# EasyEDA Pro project ProPrj_氢气传感器（已标定模块）_2025-02-25.epro

# Schematic Schematic1

## Sheets
1 P1: Board Name: Board1; Create Date: 2025-02-25; Page Name: P1; Project Name: 氢气传感器（已标定模块）; Schematic Name: Schematic1; Update Date: 2025-02-25; Company: 嘉立创EDA; Page Size: A4; Version: V1.0
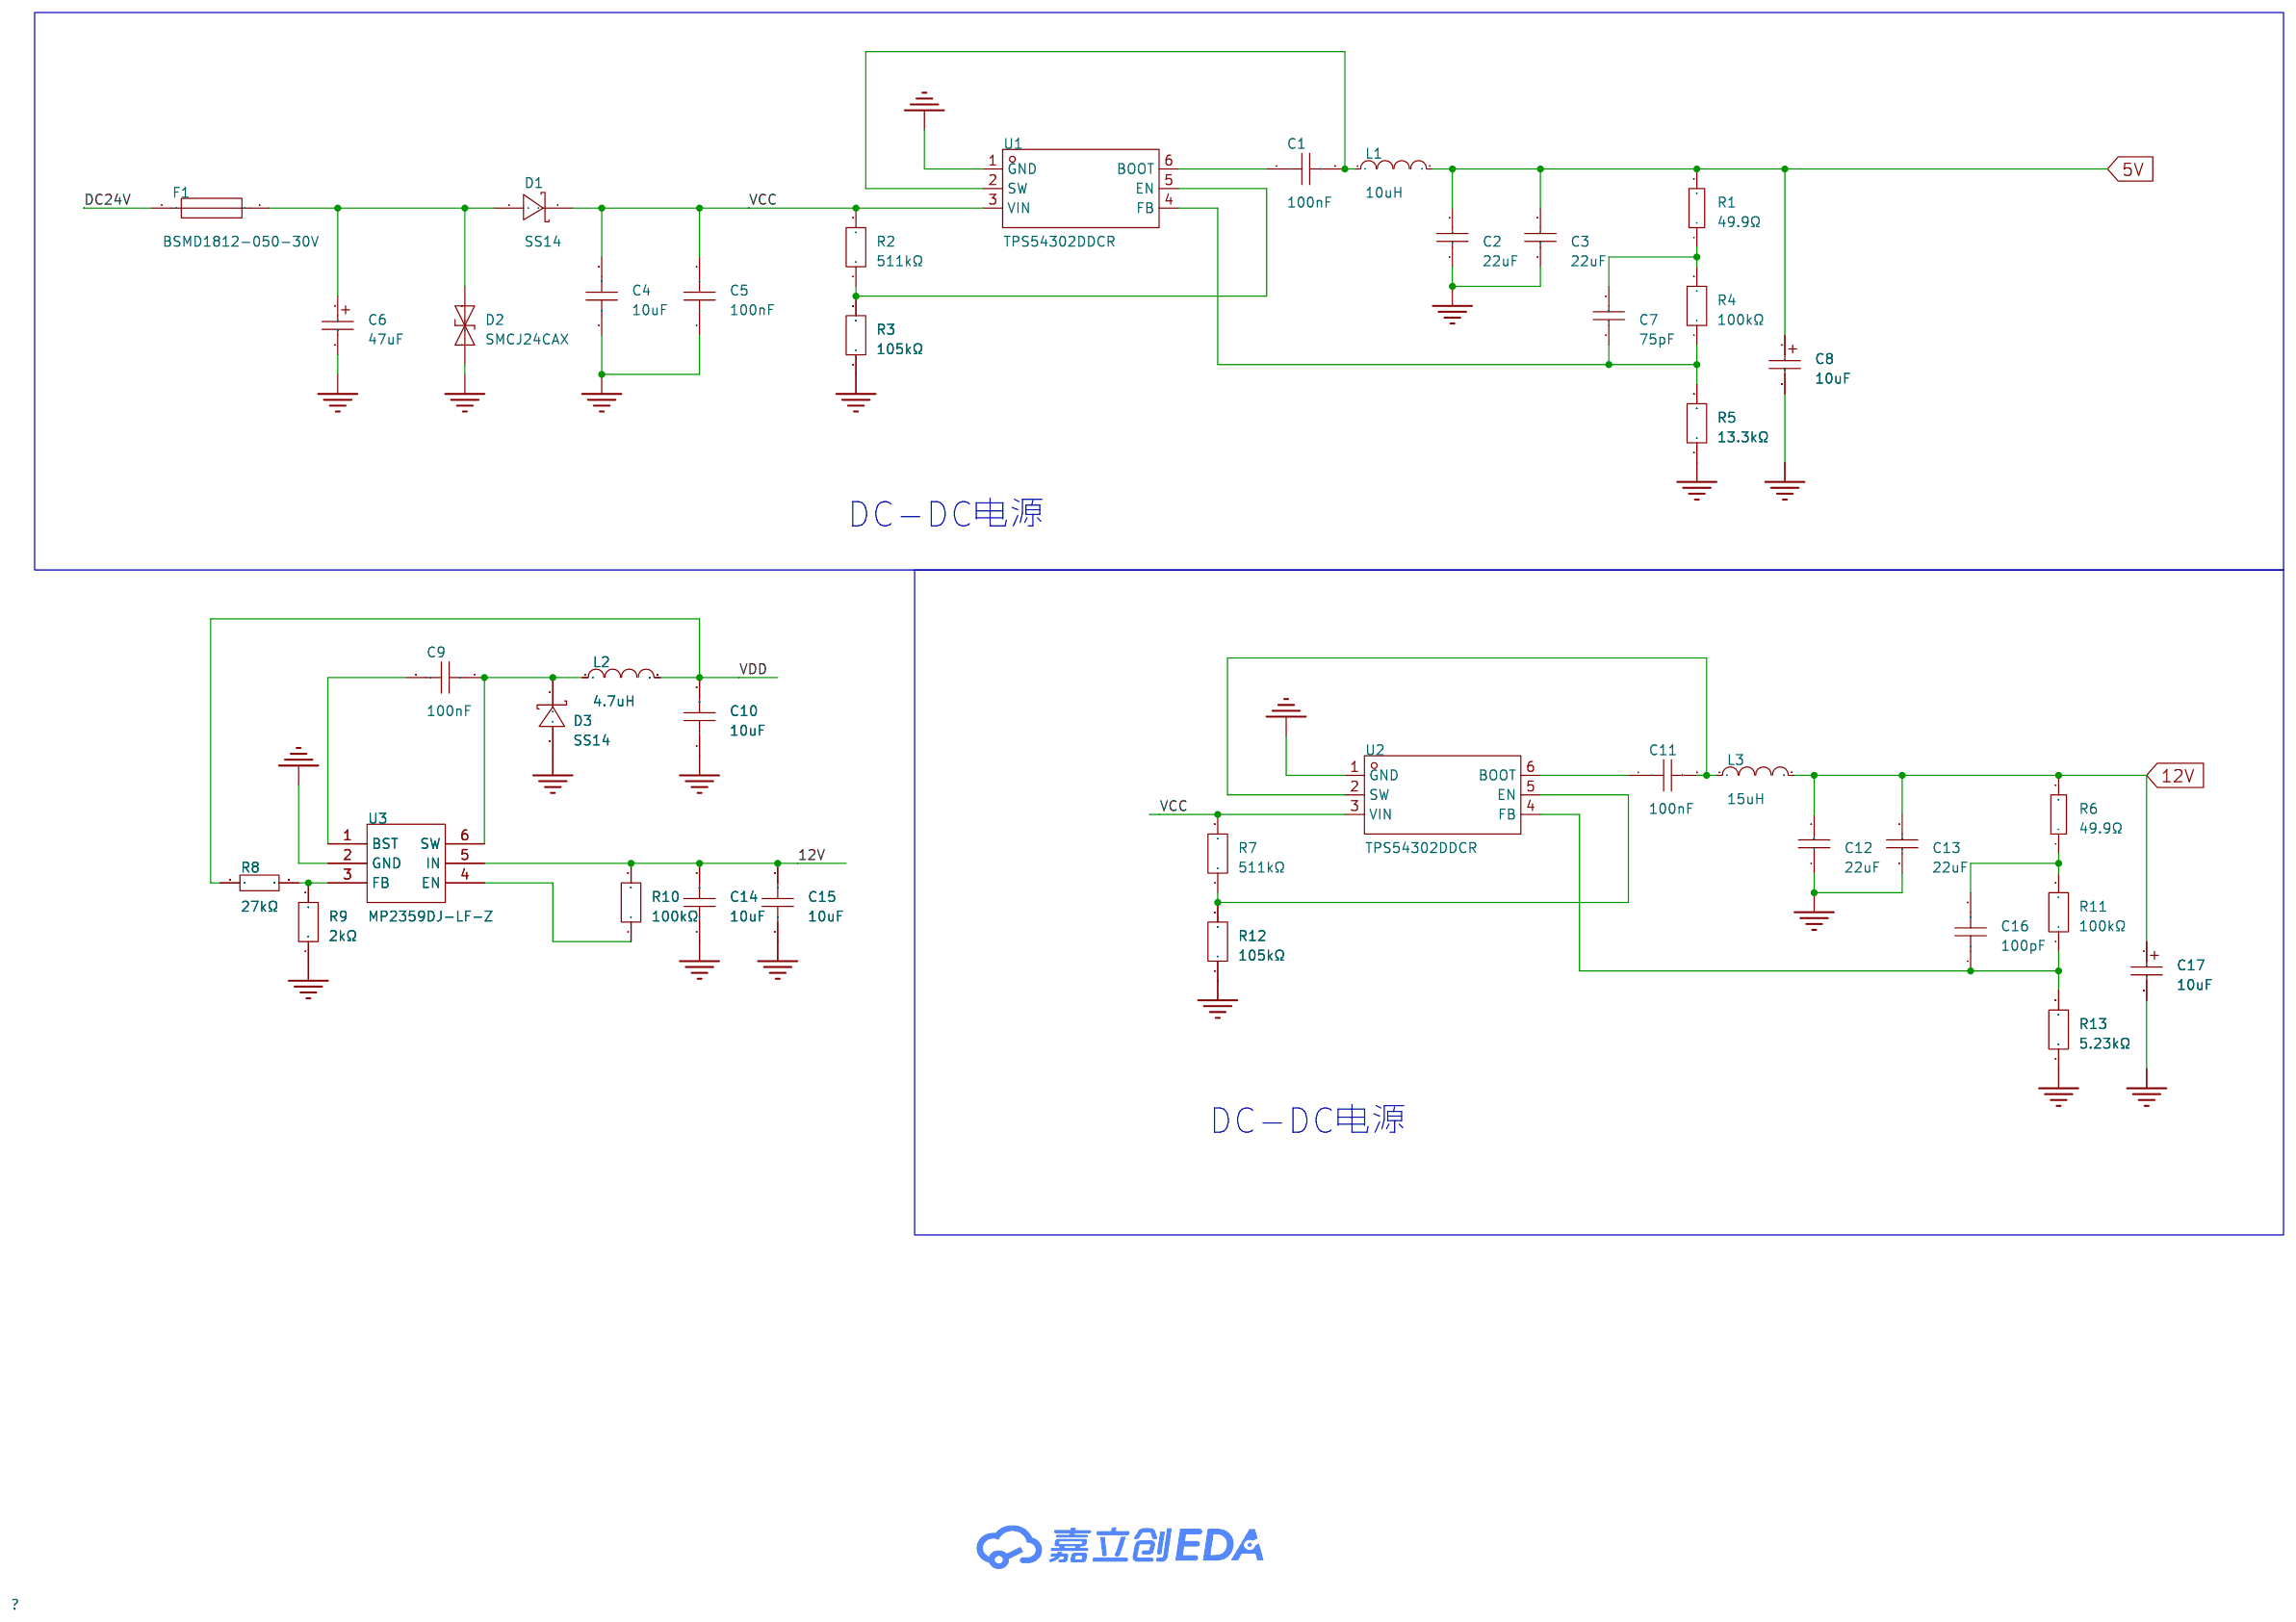
[diagram p0: P1]
2 P2: Page Name: P2
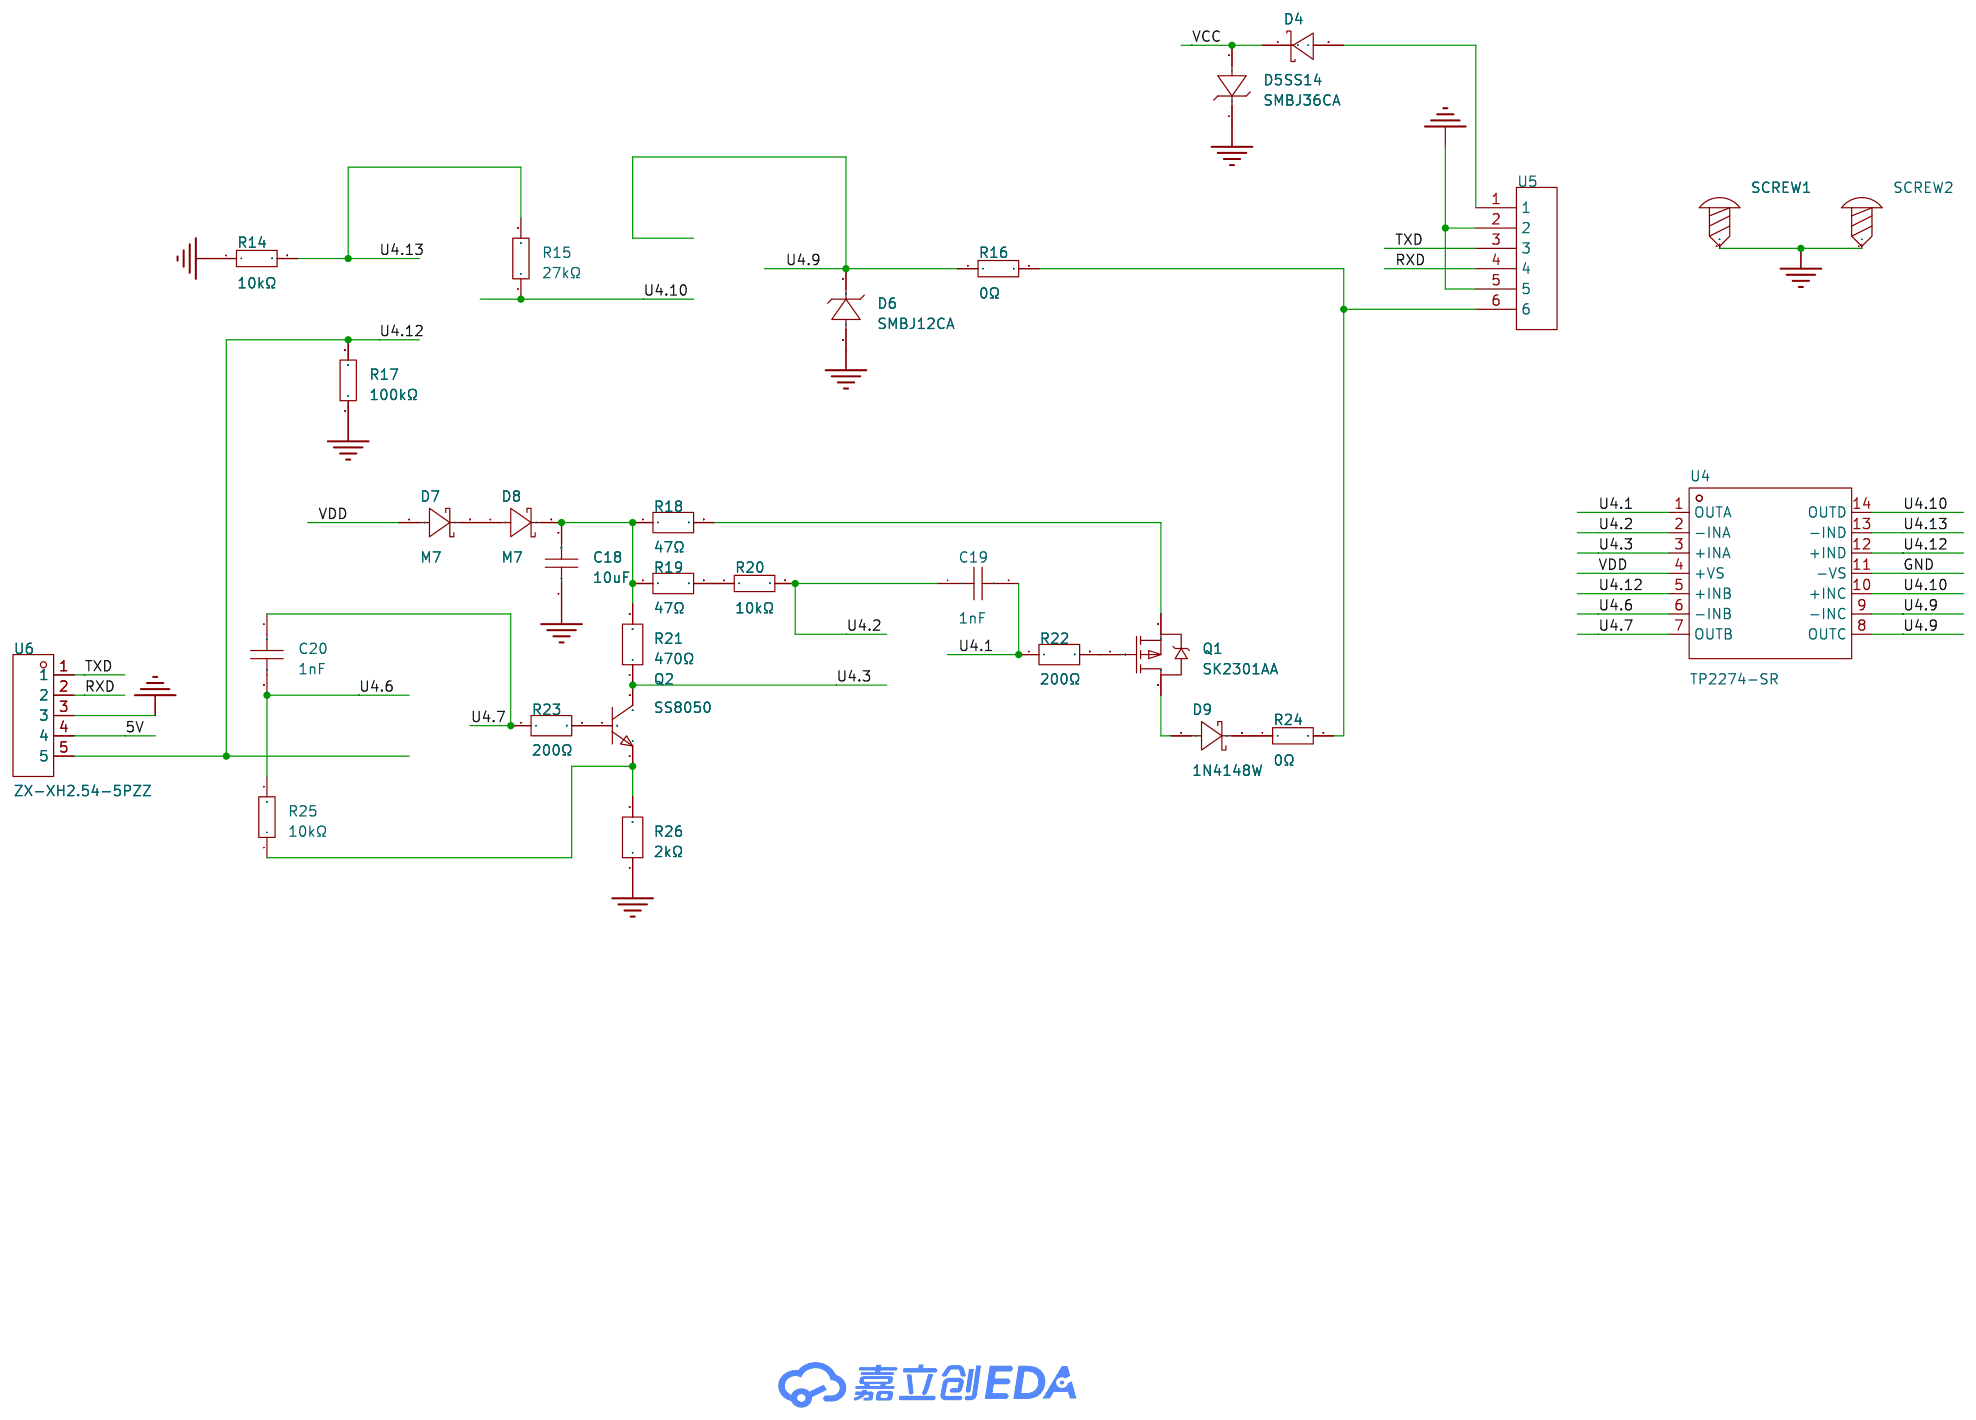
[diagram p1: P2]

## Parts
sheet P1
C1  100nF  [C0402]
C2  22uF  [C0805]
C3  22uF  [C0805]
C4  10uF  [C0603]
C5  100nF  [C0402]
C6  47uF  [CAP-SMD_L7.3-W4.3-FD]
C7  75pF  [C0402]
C8  10uF  [CASE-C_6032]
C9  100nF  [C0402]
C10  10uF  [C0603]
C11  100nF  [C0402]
C12  22uF  [C0805]
C13  22uF  [C0805]
C14  10uF  [C0603]
C15  10uF  [C0603]
C16  100pF  [C0402]
C17  10uF  [CASE-C_6032]
D1  SS14  [SMA_L4.2-W2.6-LS5.3-RD]
D2  SMCJ24CAX  [SMC_L6.9-W5.9-LS7.9-BI]
D3  SS14  [SMA_L4.3-W2.6-LS5.2-RD]
F1  BSMD1812-050-30V  [F1812]
L1  10uH  [IND-SMD_L4.4-W4.2]
L2  4.7uH  [IND-SMD_L7.0-W6.6]
L3  15uH  [IND-SMD_L4.0-W4.0]
R1  49.9Ω  [R0402]
R2  511kΩ  [R0603]
R3  105kΩ  [R0402]
R4  100kΩ  [R0402]
R5  13.3kΩ  [R0603]
R6  49.9Ω  [R0402]
R7  511kΩ  [R0603]
R8  27kΩ  [R0603]
R9  2kΩ  [R0603]
R10  100kΩ  [R0402]
R11  100kΩ  [R0402]
R12  105kΩ  [R0402]
R13  5.23kΩ  [R0603]
U1  TPS54302DDCR  [SOT-23-6_L2.9-W1.6-P0.95-LS2.8-BL]
U2  TPS54302DDCR  [SOT-23-6_L2.9-W1.6-P0.95-LS2.8-BL]
U3  MP2359DJ-LF-Z  [SOT-23-6_L2.9-W1.6-P0.95-LS2.8-BR]
sheet P2
C18  10uF  [C0603]
C19  1nF  [C0603]
C20  1nF  [C0603]
D4  SS14  [SMA_L4.3-W2.6-LS5.2-RD]
D5  SMBJ36CA  [SMB_L4.6-W3.6-LS5.4-RD]
D6  SMBJ12CA  [SMB_L4.6-W3.6-LS5.4-RD]
D7  M7  [SMA_L4.3-W2.6-LS5.0-FD]
D8  M7  [SMA_L4.3-W2.6-LS5.0-FD]
D9  1N4148W  [SOD-123_L2.7-W1.6-LS3.7-FD]
Q1  SK2301AA  [SOT-23-3_L2.9-W1.6-P1.90-LS2.8-BR]
Q2  SS8050  [SOT-23-3_L2.9-W1.3-P1.90-LS2.4-BR]
R14  10kΩ  [R0603]
R15  27kΩ  [R0603]
R16  0Ω  [R0603]
R17  100kΩ  [R0603]
R18  47Ω  [R0603]
R19  47Ω  [R0603]
R20  10kΩ  [R0603]
R21  470Ω  [R0603]
R22  200Ω  [R0603]
R23  200Ω  [R0603]
R24  0Ω  [R0603]
R25  10kΩ  [R0603]
R26  2kΩ  [R0603]
SCREW1  -  [M2螺丝]
SCREW2  -  [M2螺丝]
U4  TP2274-SR  [SOIC-14_L8.7-W3.9-P1.27-LS6.0-BL]
U5  -  [LC8+LZ8V-2.54 5PIN]
U6  ZX-XH2.54-5PZZ  [CONN-TH_5P-P2.50_ZX-XH2.54-5PZZ]

## Library data of the parts
C1 C11 = GRM155R71H104KE14D: 容值:100nF;精度:±10%;额定电压:50V;材质(温度系数):X7R;; LCSC Part Name: 100nF ±10% 50V; Supplier Part: C77020; Manufacturer: muRata(村田); Supplier Footprint: 0402; JLCPCB Part Class: 扩展库; Datasheet: https://atta.szlcsc.com/upload/public/pdf/source/20180326/C77020_39BD49C951FF1AF0DB1F1FAC5AC1E401.pdf; Supplier: LCSC; Tolerance: ±10%; Voltage Rated: 50V; Temperature Coefficient: X7R
C2 C3 C12 C13 = CC0805MKX5R8BB226: 容值:22uF;精度:±20%;额定电压:25V;材质(温度系数):X5R;; LCSC Part Name: 22uF ±20% 25V; Supplier Part: C784585; Manufacturer: YAGEO(国巨); Supplier Footprint: 0805; JLCPCB Part Class: 扩展库; Datasheet: https://atta.szlcsc.com/upload/public/pdf/source/20200508/C527238_0EA038105174A9B3D7C24FF11EEA8EC7.pdf; Supplier: LCSC; Tolerance: ±20%; Voltage Rated: 25V; Temperature Coefficient: X5R
C4 C10 C14 C15 = GRM188R6YA106MA73D: 容值:10uF;精度:±20%;额定电压:35V;材质(温度系数):X5R;; LCSC Part Name: 10uF ±20% 35V; Supplier Part: C194427; Manufacturer: muRata(村田); Supplier Footprint: 0603; JLCPCB Part Class: 扩展库; Datasheet: https://atta.szlcsc.com/upload/public/pdf/source/20210128/C194427_FCA3640823207DDB58700A82F1A19B5F.pdf; Supplier: LCSC; Tolerance: ±20%; Voltage Rated: 35V; Temperature Coefficient: X5R
C5 C9 = CGA2B3X7R1V104KT0Y0F: 容值:100nF;精度:±10%;额定电压:35V;材质(温度系数):X7R;; LCSC Part Name: 100nF ±10% 35V; Supplier Part: C343047; Manufacturer: TDK; Supplier Footprint: 0402; JLCPCB Part Class: 扩展库; Datasheet: https://atta.szlcsc.com/upload/public/pdf/source/20220825/7E289B8AEA853BBAB1E5868A343FF87B.pdf; Supplier: LCSC; Tolerance: ±10%; Voltage Rated: 35V; Temperature Coefficient: X7R
C6 = T491X476K035AT: 容值:47uF;精度:±10%;额定电压:35V;等效串联电阻:600mΩ@100kHz;; LCSC Part Name: 47uF ±10% 35V; Supplier Part: C87110; Manufacturer: KEMET(基美); Supplier Footprint: CASE-X-7343; JLCPCB Part Class: 扩展库; Datasheet: https://atta.szlcsc.com/upload/public/pdf/source/20190402/C118128_17DC26F5D7668F0165447CB640F1E367.pdf; Supplier: LCSC; Tolerance: ±10%; Rated Voltage: 35V; Equivalent Series Resistance(ESR): 600mΩ@100kHz; Operating Temperature: -55℃~+125℃
C7 = CC0402JRNPO9BN750: 容值:75pF;精度:±5%;额定电压:50V;材质(温度系数):NP0;; LCSC Part Name: 75pF ±5% 50V; Supplier Part: C107010; Manufacturer: YAGEO(国巨); Supplier Footprint: 0402; JLCPCB Part Class: 扩展库; Datasheet: https://atta.szlcsc.com/upload/public/pdf/source/20170914/C128857_1505359892143968080.pdf; Supplier: LCSC; Tolerance: ±5%; Voltage Rated: 50V; Temperature Coefficient: NP0
C8 C17 = TAJC106K035RNJ: 容值:10uF;精度:±10%;额定电压:35V;等效串联电阻:1.6Ω@100kHz;; LCSC Part Name: 10uF ±10% 35V; Supplier Part: C7211; Manufacturer: Kyocera AVX; Supplier Footprint: CASE-C-6032; JLCPCB Part Class: 扩展库; Datasheet: https://atta.szlcsc.com/upload/public/pdf/source/20160107/1457707750344.pdf; Supplier: LCSC; Tolerance: ±10%; Rated Voltage: 35V; Equivalent Series Resistance(ESR): 1.6Ω@100kHz; Operating Temperature: -55℃~+125℃
C16 = CC0402KRX7R8BB101: 容值:100pF;精度:±10%;额定电压:25V;材质(温度系数):X7R;; LCSC Part Name: 100pF ±10% 25V; Supplier Part: C541383; Manufacturer: YAGEO(国巨); Supplier Footprint: 0402; JLCPCB Part Class: 扩展库; Datasheet: https://atta.szlcsc.com/upload/public/pdf/source/20200615/C541383_DECF9DA0F3ABF65B608AAC96DDEE57A4.pdf; Supplier: LCSC; Tolerance: ±10%; Voltage Rated: 25V; Temperature Coefficient: X7R
D1 = SS14_C2480: 二极管配置:独立式;正向压降(Vf):550mV@1A;直流反向耐压(Vr):40V;整流电流:1A;; LCSC Part Name: 电压:40V 电流:1A; Supplier Part: C2480; Manufacturer: MDD(辰达半导体); Supplier Footprint: SMA(DO-214AC); JLCPCB Part Class: 基础库; Datasheet: https://atta.szlcsc.com/upload/public/pdf/source/20240710/EF24798823EE33D63F154ED67BAC5E71.pdf; Supplier: LCSC; Diode Configuration: 独立式; Forward Voltage (Vf@If): 550mV@1A; Reverse Voltage (Vr): 40V; Rectified Current: 1A; Reverse Leakage Current (Ir): 300uA@40V
D2 = SMCJ24CAX: VRWM24(V)/VBR(Min)@IT26.7(V)/VBR(Max)@IT30.7(V)/IT1(mA)/IR5(uA)/VC(Max)38.9(V)/Ipp(Max)38.6(A); LCSC Part Name: SMCJ24CA; Supplier Part: C3038088; Manufacturer: 晶扬电子; Supplier Footprint: SMC; JLCPCB Part Class: 扩展库; Datasheet: https://atta.szlcsc.com/upload/public/pdf/source/20220706/E11633D1F3056EEAC21E697B7AB2FD4F.pdf; Supplier: LCSC
D3 D4 = SS14_C83852: 正向压降(Vf):500mV@1A;直流反向耐压(Vr):40V;整流电流:1A;; LCSC Part Name: 电压:40V 电流:1A; Supplier Part: C83852; Manufacturer: onsemi(安森美); Supplier Footprint: SMA(DO-214AC); JLCPCB Part Class: 扩展库; Datasheet: https://atta.szlcsc.com/upload/public/pdf/source/20181222/C83852_041FE29A925F1DAA7D9CB1F1C69076C2.pdf; Supplier: LCSC; Forward Voltage (Vf@If): 500mV@1A; Reverse Voltage (Vr): 40V; Rectified Current: 1A; Reverse Leakage Current (Ir): 200uA@40V
F1 = BSMD1812-050-30V: 最大电压:30V;最大电流:40A;保持电流:500mA;跳闸电流:1A;; LCSC Part Name: 30V 500mA 1812自恢复; Supplier Part: C883141; Manufacturer: BHFUSE(佰宏); Supplier Footprint: 1812; JLCPCB Part Class: 扩展库; Datasheet: https://atta.szlcsc.com/upload/public/pdf/source/20230512/6ED7FF50F668B3AF958C55F12246A840.pdf; Supplier: LCSC; Operating Voltage (Max): 30V; Current Rating (Max): 40A; Hold Current: 500mA; Trip Current: 1A; Power Dissipation: 800mW; Resistance - Initial (Ri) (Min): 150mΩ; Resistance - Post Trip (R1) (Max): 1.4Ω; Maximum Time to Trip: 150ms; Operating Temperature: -40℃~+85℃
L1 = FXL0420-100-M: 电感值:10uH;精度:±20%;额定电流:1.6A;饱和电流(Isat):2.2A;类型:一体成型电感;; LCSC Part Name: 10uH ±20% 2.2A; Supplier Part: C177242; Manufacturer: cjiang(长江微电); Supplier Footprint: SMD,4.2x4.4mm; JLCPCB Part Class: 扩展库; Datasheet: https://atta.szlcsc.com/upload/public/pdf/source/20240426/3189EA8206330E2108542F9E34E540E7.pdf; Supplier: LCSC; Tolerance: ±20%; Rated Current: 1.6A; Saturation Current (Isat): 2.2A; DC Resistance (DCR): 282mΩ; Type: 一体成型电感
L2 = FXL0630-4R7-M: 电感值:4.7uH;精度:±20%;额定电流:6A;饱和电流(Isat):9A;类型:一体成型电感;; LCSC Part Name: 4.7uH ±20% 9A; Supplier Part: C167220; Manufacturer: cjiang(长江微电); Supplier Footprint: SMD,6.6x7mm; JLCPCB Part Class: 扩展库; Datasheet: https://atta.szlcsc.com/upload/public/pdf/source/20240426/3189EA8206330E2108542F9E34E540E7.pdf; Supplier: LCSC; Tolerance: ±20%; Rated Current: 6A; Saturation Current (Isat): 9A; DC Resistance (DCR): 33mΩ; Type: 一体成型电感
L3 = FHD4020S-150MT: 电感值:15uH;精度:±20%;额定电流:1.2A;饱和电流(Isat):2.8A;; LCSC Part Name: 15uH ±20% 2.8A; Supplier Part: C602033; Manufacturer: cjiang(长江微电); Supplier Footprint: SMD,4x4mm; JLCPCB Part Class: 扩展库; Datasheet: https://atta.szlcsc.com/upload/public/pdf/source/20200609/C601990_BCEA243EC4DA0A9A288AA78A6DFB48A5.pdf; Supplier: LCSC; Tolerance: ±20%; Rated Current: 1.2A; Saturation Current (Isat): 2.8A; DC Resistance (DCR): 305mΩ
R1 R6 = PTFR0402B49R9P9: 电阻类型:薄膜电阻;阻值:49.9Ω;精度:±0.1%;功率:60mW;最大工作电压:75V;温度系数:±25ppm/℃;; LCSC Part Name: 薄膜电阻 49.9Ω ±0.1% 60mW; Supplier Part: C478876; Manufacturer: RESI(开步睿思); Supplier Footprint: 0402; JLCPCB Part Class: 扩展库; Datasheet: https://atta.szlcsc.com/upload/public/pdf/source/20240506/11BDC7478D84177AC2A5326A65B6EB29.pdf; Supplier: LCSC; Type: 薄膜电阻; Tolerance: ±0.1%; Power(Watts): 60mW; Overload Voltage (Max): 75V; Temperature Coefficient: ±25ppm/℃; Operating Temperature Range: -55℃~+125℃
R2 R7 = ARG03BTC5113: 电阻类型:薄膜电阻;阻值:511kΩ;精度:±0.1%;功率:100mW;最大工作电压:75V;温度系数:±25ppm/℃;; LCSC Part Name: 薄膜电阻 511kΩ ±0.1% 100mW; Supplier Part: C2684557; Manufacturer: Viking(光颉); Supplier Footprint: 0603; JLCPCB Part Class: 扩展库; Datasheet: https://atta.szlcsc.com/upload/public/pdf/source/20200117/C485675_99063924B4564AF910B7BE66DA8EFA49.pdf; Supplier: LCSC; Type: 薄膜电阻; Tolerance: ±0.1%; Power(Watts): 100mW; Overload Voltage (Max): 75V; Temperature Coefficient: ±25ppm/℃; Operating Temperature Range: -55℃~+155℃
R3 R12 = RT0402BRD07105KL: 电阻类型:薄膜电阻;阻值:105kΩ;精度:±0.1%;功率:62.5mW;温度系数:±25ppm/℃;; LCSC Part Name: 薄膜电阻 105kΩ ±0.1% 62.5mW; Supplier Part: C852475; Manufacturer: YAGEO(国巨); Supplier Footprint: 0402; JLCPCB Part Class: 扩展库; Datasheet: https://atta.szlcsc.com/upload/public/pdf/source/20200610/C326738_5639A9F1B6EB6E4AE2197577D3456E7F.pdf; Supplier: LCSC; Type: 薄膜电阻; Tolerance: ±0.1%; Power(Watts): 62.5mW; Temperature Coefficient: ±25ppm/℃; Operating Temperature Range: -55℃~+155℃
R4 R10 R11 = RT0402BRD07100KL: 电阻类型:薄膜电阻;阻值:100kΩ;精度:±0.1%;功率:62.5mW;最大工作电压:50V;温度系数:±25ppm/℃;; LCSC Part Name: 薄膜电阻 100kΩ ±0.1% 62.5mW; Supplier Part: C852472; Manufacturer: YAGEO(国巨); Supplier Footprint: 0402; JLCPCB Part Class: 扩展库; Datasheet: https://atta.szlcsc.com/upload/public/pdf/source/20210326/C852472_6283D268A9C33EA67274729CC55E28B1.pdf; Supplier: LCSC; Type: 薄膜电阻; Tolerance: ±0.1%; Power(Watts): 62.5mW; Overload Voltage (Max): 50V; Temperature Coefficient: ±25ppm/℃; Operating Temperature Range: -55℃~+155℃
R5 = RT0603BRD0713K3L: 电阻类型:薄膜电阻;阻值:13.3kΩ;精度:±0.1%;功率:100mW;最大工作电压:75V;温度系数:±25ppm/℃;; LCSC Part Name: 薄膜电阻 13.3kΩ ±0.1% 100mW; Supplier Part: C861117; Manufacturer: YAGEO(国巨); Supplier Footprint: 0603; JLCPCB Part Class: 扩展库; Datasheet: https://atta.szlcsc.com/upload/public/pdf/source/20200610/C326738_5639A9F1B6EB6E4AE2197577D3456E7F.pdf; Supplier: LCSC; Type: 薄膜电阻; Tolerance: ±0.1%; Power(Watts): 100mW; Overload Voltage (Max): 75V; Temperature Coefficient: ±25ppm/℃; Operating Temperature Range: -55℃~+155℃
R8 R15 = RT0603BRE0727KL: 电阻类型:薄膜电阻;阻值:27kΩ;精度:±0.1%;功率:100mW;最大工作电压:75V;温度系数:±50ppm/℃;; LCSC Part Name: 薄膜电阻 27kΩ ±0.1% 100mW; Supplier Part: C326751; Manufacturer: YAGEO(国巨); Supplier Footprint: 0603; JLCPCB Part Class: 扩展库; Datasheet: https://atta.szlcsc.com/upload/public/pdf/source/20181031/C326751_F0C7ED3CCC78679E2CE8C1AED7A94608.pdf; Supplier: LCSC; Type: 薄膜电阻; Tolerance: ±0.1%; Power(Watts): 100mW; Overload Voltage (Max): 75V; Temperature Coefficient: ±50ppm/℃; Operating Temperature Range: -55℃~+155℃
R9 R26 = RT0603BRD072KL: 电阻类型:薄膜电阻;阻值:2kΩ;精度:±0.1%;功率:100mW;温度系数:±25ppm/℃;; LCSC Part Name: 薄膜电阻 2kΩ ±0.1% 100mW; Supplier Part: C728588; Manufacturer: YAGEO(国巨); Supplier Footprint: 0603; JLCPCB Part Class: 扩展库; Datasheet: https://atta.szlcsc.com/upload/public/pdf/source/20200814/C723483_9C38DBFE9BAEFED0FBB9716EAA9FF07C.pdf; Supplier: LCSC; Type: 薄膜电阻; Tolerance: ±0.1%; Power(Watts): 100mW; Temperature Coefficient: ±25ppm/℃; Operating Temperature Range: -55℃~+155℃
R13 = RT0603BRD075K23L: 电阻类型:薄膜电阻;阻值:5.23kΩ;精度:±0.1%;功率:100mW;温度系数:±25ppm/℃;; LCSC Part Name: 薄膜电阻 5.23kΩ ±0.1% 100mW; Supplier Part: C861485; Manufacturer: YAGEO(国巨); Supplier Footprint: 0603; JLCPCB Part Class: 扩展库; Datasheet: https://atta.szlcsc.com/upload/public/pdf/source/20200610/C326738_5639A9F1B6EB6E4AE2197577D3456E7F.pdf; Supplier: LCSC; Type: 薄膜电阻; Tolerance: ±0.1%; Power(Watts): 100mW; Temperature Coefficient: ±25ppm/℃; Operating Temperature Range: -55℃~+155℃
U1 U2 = TPS54302DDCR: 功能类型:降压型;输出类型:固定;工作电压:4.5V~28V;输出电压:5V;输出电流:3A;; LCSC Part Name: 4.5V至28V输入、3A输出、EMI友好的同步降压转换器; Supplier Part: C311983; Manufacturer: TI(德州仪器); Supplier Footprint: TSOT-23-6; JLCPCB Part Class: 扩展库; Datasheet: https://www.ti.com/cn/lit/gpn/tps54302; Supplier: LCSC; Function: 降压型; Output Type: 固定; Input Voltage: 4.5V~28V; Output Voltage: 5V; Output Current: 3A; Switching Frequency: 400kHz; Operating Temperature: -40℃~+125℃; Synchronous Rectification: 是; Number of Outputs: 1; Topology: 降压式; Quiescent Current (Iq): 45uA; Switch tube (built-in/external): 内置
U3 = MP2359DJ-LF-Z: 功能类型:降压型;输出类型:可调;工作电压:4.5V~24V;输出电压:810mV~15V;输出电流:1.2A;; Supplier Part: C14259; Manufacturer: MPS(芯源); Supplier Footprint: TSOT-23-6; JLCPCB Part Class: 扩展库; Datasheet: https://atta.szlcsc.com/upload/public/pdf/source/20240129/21CBBF6F83E2E7F822A0D20325A1F6D1.pdf; Supplier: LCSC; Function: 降压型; Output Type: 可调; Input Voltage: 4.5V~24V; Output Voltage: 810mV~15V; Output Current: 1.2A; Switching Frequency: 1.4MHz; Operating Temperature: -40℃~+85℃@(TA); Synchronous Rectification: 否; Number of Outputs: 1; Topology: 降压式; Switch tube (built-in/external): 内置
C18 = HGC0603R5106M350NTHJ: 容值:10uF;精度:±20%;额定电压:35V;材质(温度系数):X5R;; LCSC Part Name: 10uF ±20% 35V; Supplier Part: C22367827; Manufacturer: Chinocera(华瓷); Supplier Footprint: 0603; JLCPCB Part Class: 扩展库; Datasheet: https://atta.szlcsc.com/upload/public/pdf/source/20240326/08136F0414FFF46DD07E47F2D66E675E.pdf; Supplier: LCSC; Tolerance: ±20%; Voltage Rated: 35V; Temperature Coefficient: X5R
C19 C20 = CC0603KRX7R8BB102: 容值:1nF;精度:±10%;额定电压:25V;材质(温度系数):X7R;; LCSC Part Name: 1nF ±10% 25V; Supplier Part: C519404; Manufacturer: YAGEO(国巨); Supplier Footprint: 0603; JLCPCB Part Class: 扩展库; Datasheet: https://atta.szlcsc.com/upload/public/pdf/source/20200423/C519404_A71349FA810DAEA115DB745232C4DA90.pdf; Supplier: LCSC; Tolerance: ±10%; Voltage Rated: 25V; Temperature Coefficient: X7R
D5 = SMBJ36CA_C19077589: 极性:双向;反向截止电压(Vrwm):36V;钳位电压:58.1V;峰值脉冲电流(Ipp):10.33A;峰值脉冲功率(Ppp):600W;击穿电压:40V;; Supplier Part: C19077589; Manufacturer: 宏嘉诚; Supplier Footprint: SMB; JLCPCB Part Class: Extended Part; Datasheet: https://atta.szlcsc.com/upload/public/pdf/source/20250107/474F05451FC8AB27D7FA0238914F96F6.pdf; Supplier: LCSC; Polarity: 双向; Reverse Stand-Off Voltage (Vrwm): 36V; Clamping Voltage: 58.1V; Peak Pulse Current (Ipp): 10.33A; Peak Pulse Power Dissipation (Ppp): 600W; Voltage - Breakdown: 40V; Reverse Leakage Current (Ir): 5uA; Number of Channels: 单路; Type: TVS
D6 = SMBJ12CA_C19077566: 极性:双向;反向截止电压(Vrwm):12V;最大钳位电压:19.9V;峰值脉冲电流(Ipp)@10/1000us:30.15A;峰值脉冲功率(Ppp)@10/1000us:600W;击穿电压:13.3V;; Supplier Part: C19077566; Manufacturer: 宏迦橙; Supplier Footprint: SMB; JLCPCB Part Class: Extended Part; Datasheet: https://atta.szlcsc.com/upload/public/pdf/source/20240521/70EB82B9CFA2B663C3BC6584026036D0.pdf; Supplier: LCSC; polarity: 双向; Reverse Stand-Off Voltage (Vrwm): 12V; Maximum Clamping Voltage: 19.9V; Peak Pulse Current (Ipp)@10/1000us: 30.15A; Peak Pulse Power Dissipation (Ppp)@10/1000us: 600W; Breakdown Voltage: 13.3V; Reverse Leakage Current (Ir): 5uA; Number of Lines: 单路; Operating Temperature: -55℃~+155℃; Type: TVS
D7 D8 = M7_C7420350: 二极管配置:独立式;正向压降(Vf):1.1V@1A;直流反向耐压(Vr):1kV;整流电流:1A;; Supplier Part: C7420350; Manufacturer: 宏迦橙; Supplier Footprint: SMA(DO-214AC); JLCPCB Part Class: 扩展库; Datasheet: https://atta.szlcsc.com/upload/public/pdf/source/20230828/CA59226B69C4023C11E82B13108B998C.pdf; Supplier: LCSC; Diode Configuration: 独立式; Forward Voltage (Vf@If): 1.1V@1A; Reverse Voltage (Vr): 1kV; Rectified Current: 1A; Reverse Leakage Current (Ir): 5uA@1000V
D9 = 1N4148W_C7420318: 二极管配置:独立式;正向压降(Vf):1.25V@150mA;直流反向耐压(Vr):100V;整流电流:150mA;反向恢复时间(trr):4ns;; Supplier Part: C7420318; Manufacturer: 宏迦橙; Supplier Footprint: SOD-123; JLCPCB Part Class: 扩展库; Datasheet: https://atta.szlcsc.com/upload/public/pdf/source/20230828/E5C3F7A4272052930A7E03B75759BF50.pdf; Supplier: LCSC; Diode Configuration: 独立式; Forward Voltage (Vf@If): 1.25V@150mA; Reverse Voltage (Vr): 100V; Rectified Current: 150mA; Reverse Leakage Current (Ir): 1uA@75V; Reverse Recovery Time (trr): 4ns; Operating Temperature: -55℃~+150℃
Q1 = SK2301AA: 类型:P沟道;漏源电压(Vdss):16V;连续漏极电流(Id):3A;功率(Pd):-;导通电阻(RDS(on)@Vgs,Id):160mΩ@4.5V,3A;阈值电压(Vgs(th)@Id):1.5V@250uA;; LCSC Part Name: P沟道 耐压:16V 电流:3A; Supplier Part: C118316; Manufacturer: SHIKUES(时科); Supplier Footprint: SOT-23; JLCPCB Part Class: 扩展库; Datasheet: https://atta.szlcsc.com/upload/public/pdf/source/20170722/1500687322978.pdf; Supplier: LCSC; Type: P沟道; Drain Source Voltage (Vdss): 16V; Continuous Drain Current (Id): 3A; Drain Source On Resistance (RDS(on)@Vgs,Id): 160mΩ@4.5V,3A; Gate Threshold Voltage (Vgs(th)@Id): 1.5V@250uA
Q2 = SS8050_C7420370: 晶体管类型:NPN;集电极电流(Ic):1.5A;集射极击穿电压(Vceo):25V;功率(Pd):300mW;直流电流增益(hFE@Ic,Vce):120@100mA,1.0V;; LCSC Part Name: 耐压:25V 电流:1.5A NPN H档 200-350; Supplier Part: C7420370; Manufacturer: 宏迦橙; Supplier Footprint: SOT-23; JLCPCB Part Class: 扩展库; Datasheet: https://atta.szlcsc.com/upload/public/pdf/source/20231222/9C4050A7669EB24B3ACD0418218817FD.pdf; Supplier: LCSC; Transistor Type: NPN; Collector Current (Ic): 1.5A; Collector-Emitter Breakdown Voltage (Vceo): 25V; Power Dissipation (Pd): 300mW; DC Current Gain (hFE@Ic,Vce): 120@100mA,1.0V; Transition Frequency (fT): 100MHz; Collector Cut-Off Current (Icbo): 100nA; Collector-Emitter Saturation Voltage (VCE(sat)@Ic,Ib): 500mV@800mA,80mA; Operating Temperature: -55℃~+150℃
R14 R20 R25 = RT0603BRD0710KL: 电阻类型:薄膜电阻;阻值:10kΩ;精度:±0.1%;功率:100mW;最大工作电压:75V;温度系数:±25ppm/℃;; LCSC Part Name: 薄膜电阻 10kΩ ±0.1% 100mW; Supplier Part: C95204; Manufacturer: YAGEO(国巨); Supplier Footprint: 0603; JLCPCB Part Class: 扩展库; Datasheet: https://atta.szlcsc.com/upload/public/pdf/source/20170217/1487301593756.pdf; Supplier: LCSC; Type: 薄膜电阻; Tolerance: ±0.1%; Power(Watts): 100mW; Overload Voltage (Max): 75V; Temperature Coefficient: ±25ppm/℃; Operating Temperature Range: -55℃~+155℃
R16 R24 = RC0603FR-070RL: 电阻类型:厚膜电阻;阻值:0Ω;精度:±1%;功率:100mW;最大工作电压:75V;温度系数:-;; LCSC Part Name: 厚膜电阻 0Ω ±1% 100mW; Supplier Part: C100044; Manufacturer: YAGEO(国巨); Supplier Footprint: 0603; JLCPCB Part Class: 扩展库; Datasheet: https://atta.szlcsc.com/upload/public/pdf/source/20180316/70C0E2BDAE7FCC62C531A5A58D202EE1.pdf; Supplier: LCSC; Type: 厚膜电阻; Tolerance: ±1%; Power(Watts): 100mW; Overload Voltage (Max): 75V; Operating Temperature Range: -55℃~+155℃
R17 = RT0603BRD07100KL: 电阻类型:薄膜电阻;阻值:100kΩ;精度:±0.1%;功率:100mW;最大工作电压:75V;温度系数:±25ppm/℃;; LCSC Part Name: 薄膜电阻 100kΩ ±0.1% 100mW; Supplier Part: C122538; Manufacturer: YAGEO(国巨); Supplier Footprint: 0603; JLCPCB Part Class: 扩展库; Datasheet: https://atta.szlcsc.com/upload/public/pdf/source/20170721/C122538_1500619326323834092.pdf; Supplier: LCSC; Type: 薄膜电阻; Tolerance: ±0.1%; Power(Watts): 100mW; Overload Voltage (Max): 75V; Temperature Coefficient: ±25ppm/℃; Operating Temperature Range: -55℃~+155℃
R18 R19 = RT0603BRE0747RL: 电阻类型:薄膜电阻;阻值:47Ω;精度:±0.1%;功率:100mW;最大工作电压:75V;温度系数:±50ppm/℃;; LCSC Part Name: 薄膜电阻 47Ω ±0.1% 100mW; Supplier Part: C705861; Manufacturer: YAGEO(国巨); Supplier Footprint: 0603; JLCPCB Part Class: 扩展库; Datasheet: https://atta.szlcsc.com/upload/public/pdf/source/20200720/C705861_38135A8C7AA70109CA13E06D71556DDE.pdf; Supplier: LCSC; Type: 薄膜电阻; Tolerance: ±0.1%; Power(Watts): 100mW; Overload Voltage (Max): 75V; Temperature Coefficient: ±50ppm/℃; Operating Temperature Range: -55℃~+155℃
R21 = RT0603BRD07470RL: 电阻类型:薄膜电阻;阻值:470Ω;精度:±0.1%;功率:100mW;最大工作电压:75V;温度系数:±25ppm/℃;; LCSC Part Name: 薄膜电阻 470Ω ±0.1% 100mW; Supplier Part: C705779; Manufacturer: YAGEO(国巨); Supplier Footprint: 0603; JLCPCB Part Class: 扩展库; Datasheet: https://atta.szlcsc.com/upload/public/pdf/source/20200720/C705779_87B2B0C8A7C434E286EFE71A626B886E.pdf; Supplier: LCSC; Type: 薄膜电阻; Tolerance: ±0.1%; Power(Watts): 100mW; Overload Voltage (Max): 75V; Temperature Coefficient: ±25ppm/℃; Operating Temperature Range: -55℃~+155℃
R22 R23 = RT0603BRD07200RL: 电阻类型:薄膜电阻;阻值:200Ω;精度:±0.1%;功率:100mW;最大工作电压:75V;温度系数:±25ppm/℃;; LCSC Part Name: 薄膜电阻 200Ω ±0.1% 100mW; Supplier Part: C861216; Manufacturer: YAGEO(国巨); Supplier Footprint: 0603; JLCPCB Part Class: 扩展库; Datasheet: https://atta.szlcsc.com/upload/public/pdf/source/20181009/C309664_C7CEF5A7F4D0541F96EF5E54D941D229.pdf; Supplier: LCSC; Type: 薄膜电阻; Tolerance: ±0.1%; Power(Watts): 100mW; Overload Voltage (Max): 75V; Temperature Coefficient: ±25ppm/℃; Operating Temperature Range: -55℃~+155℃
SCREW1 SCREW2 = M2螺丝: Supplier Footprint: 插件
U4 = TP2274-SR: 放大器数:四路;增益带宽积(GBP):7MHz;压摆率(SR):20V/us;; Supplier Part: C95870; Manufacturer: 3PEAK; Supplier Footprint: SOIC-14; JLCPCB Part Class: 扩展库; Datasheet: https://atta.szlcsc.com/upload/public/pdf/source/20170227/1488160676858.pdf; Supplier: LCSC; Number of Circuits: 四路; Gain Bandwidth Product(GBP): 7MHz; Slew Rate(SR): 20V/us; Supply Current: 900uA
U5 = LZ8V-2.54-6P: 2.54节距PCB插拔连接器_P6IN_联捷
U6 = ZX-XH2.54-5PZZ: 插针结构:1x5P;间距:2.5mm;安装方式:直插;参考系列:XH;总PIN数:5P;排数:1;每排PIN数:5;行距:-;额定电流:3A;触头材质:黄铜;触头镀层:锡;工作温度范围:-25℃~+85℃;; LCSC Part Name: 1x5P 间距:2.5mm 直插 系列:XH; Supplier Part: C7429635; Manufacturer: Megastar(兆星); Supplier Footprint: 插件,P=2.5mm; JLCPCB Part Class: 扩展库; Datasheet: https://atta.szlcsc.com/upload/public/pdf/source/20230619/60EEF4ADD558E90BFFACF5D939816781.pdf; Supplier: LCSC; Pins Structure: 1x5P; Pitch: 2.5mm; Mounting Type: 直插; Reference Series: XH; Number of Pins: 5P; Number of Rows: 1; Number of PINs Per Row: 5; Rated Current: 3A; Contact Material: 黄铜; Contact Plating: 锡; Operating Temperature: -25℃~+85℃; Rated Voltage (Max): 250V; Plastic Material: PA66; Flame Retardant Rating: UL94V-0; Color: 白色; Z-Height of the Board: 7mm; X-Length of Bottom Edge on Board (Spacing Line): 15mm; Y-Width of Bottom Edge on Board: 5.9mm

## Nets
5V: C2.2 C3.2 C8.1 L1.2 R1.2 U6.4
12V: C12.2 C13.2 C14.2 C15.2 C17.1 L3.2 R6.2 R10.2 U3.5(IN)
GND: C2.1 C3.1 C4.1 C5.1 C6.2 C8.2 C10.1 C12.1 C13.1 C14.1 C15.1 C17.2 C18.1 D2.1(K) D3.2(A) D5.1(K) D6.2(A) R3.1 R5.1 R9.1 R12.1 R13.1 R14.1 R17.1 R26.1 SCREW1.1 SCREW2.1 U1.1(GND) U2.1(GND) U3.2(GND) U4.11(-VS) U5.2 U5.5 U6.3
VCC: C4.2 C5.2 D1.1(K) D4.1(K) D5.2(A) R2.2 R7.2 U1.3(VIN) U2.3(VIN)
VDD: C10.2 D7.1(A) L2.2 R8.1 U4.4(+VS)
DC24V: F1.1
RXD: U5.4 U6.2
TXD: U5.3 U6.1
U4.1: C19.2 R22.1 U4.1(OUTA)
U4.2: C19.1 R20.2 U4.2(-INA)
U4.3: Q2.3(C) R21.1 U4.3(+INA)
U4.6: C20.2 R25.2 U4.6(-INB)
U4.7: C20.1 R23.1 U4.7(OUTB)
U4.9: D6.1(K) R16.1 U4.8(OUTC) U4.9(-INC)
U4.10: R15.1 U4.10(+INC) U4.14(OUTD)
U4.12: R17.2 U4.5(+INB) U4.12(+IND) U6.5
U4.13: R14.2 R15.2 U4.13(-IND)
$1N943: C6.1 D1.2(A) D2.2(A) F1.2
$1N949: R2.1 R3.2 U1.5(EN)
$1N950: C1.1 U1.6(BOOT)
$1N951: C1.2 L1.1 U1.2(SW)
$1N954: C7.2 R1.1 R4.2
$1N955: C7.1 R4.1 R5.2 U1.4(FB)
$1N1502: R7.1 R12.2 U2.5(EN)
$1N1503: C11.1 U2.6(BOOT)
$1N1504: C11.2 L3.1 U2.2(SW)
$1N1507: C16.2 R6.1 R11.2
$1N1508: C16.1 R11.1 R13.2 U2.4(FB)
$1N1920: C9.1 D3.1(K) L2.1 U3.6(SW)
$1N2087: R10.1 U3.4(EN)
$1N2108: C9.2 U3.1(BST)
$1N2261: R8.2 R9.2 U3.3(FB)
$2N857: Q2.1(B) R23.2
$2N979: C18.2 D8.2(K) R18.1 R19.1 R21.2
$2N983: R19.2 R20.1
$2N1088: D7.2(K) D8.1(A)
$2N1306: Q2.2(E) R25.1 R26.2
$2N1462: Q1.1(G) R22.2
$2N1466: Q1.2(S) R18.2
$2N1508: D9.1(A) Q1.3(D)
$2N2130: D9.2(K) R24.1
$2N2230: D4.2(A) U5.1
$2N2492: R16.2 R24.2 U5.6

## Notes on the sheets
sheet 1
- DC-DC电源
- DC-DC电源

# Board PCB1
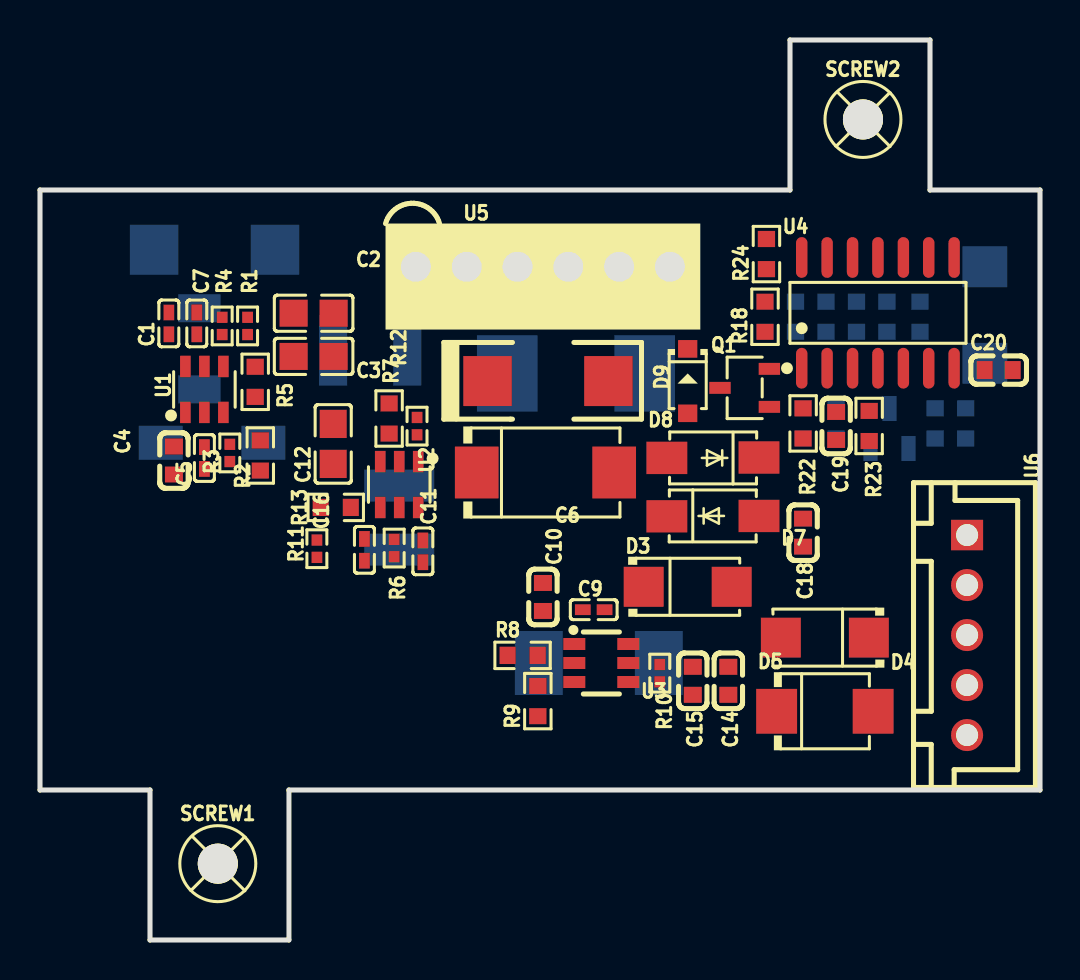
[diagram p2: board, top side]
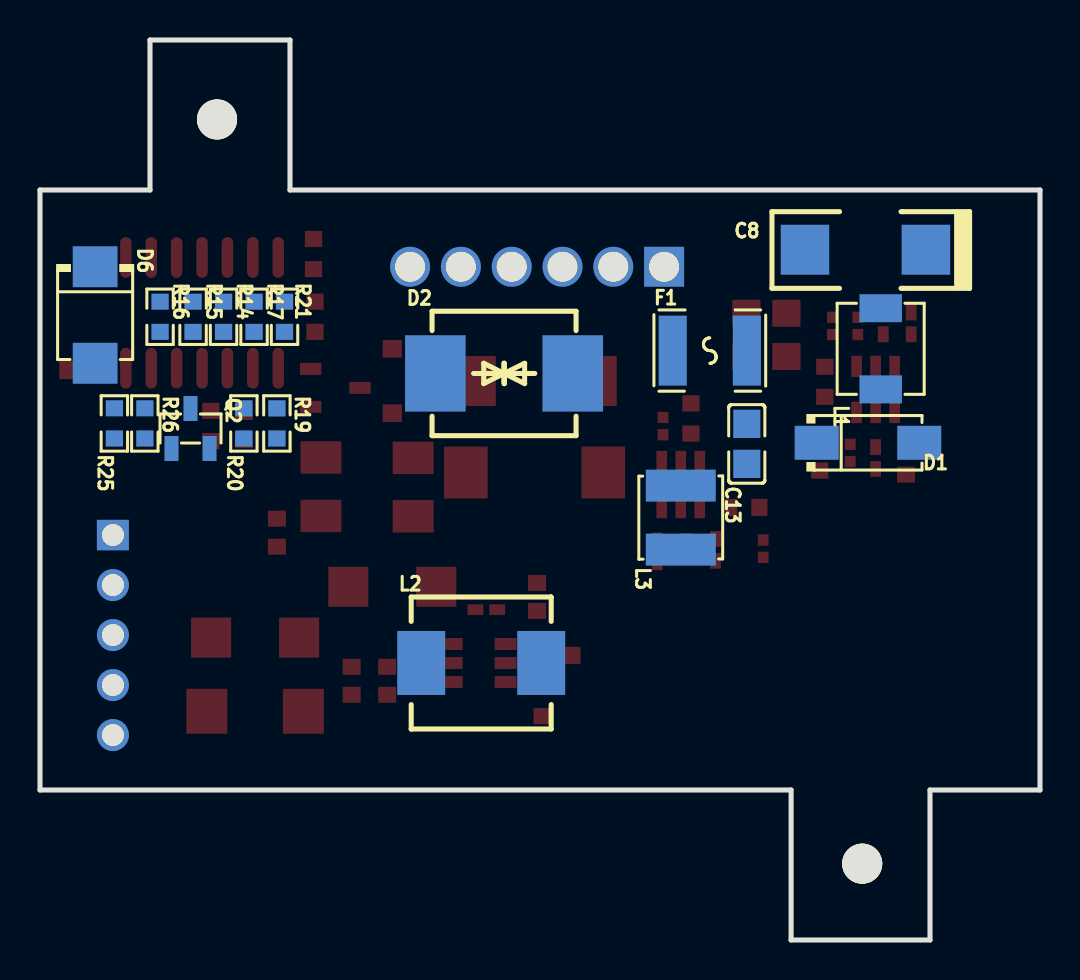
[diagram p3: board, bottom side, seen from below]

Outline 50 x 45 mm; copper layers: Top Layer, Bottom Layer. Coordinates in mm from the lower left corner of the outline.
Outline path: 0,7.5 0,37.5 37.5,37.5 37.5,45 44.5,45 44.5,37.5 50,37.5 50,7.5 12.45,7.5 12.45,0 5.5,0 5.5,7.5 0,7.5
Stack: Top Layer 0.035mm / Dielectric1 1.51mm FR4 er 4.5 / Bottom Layer 0.035mm

## Design rules (mm)
template: JLCPCB Capability(Two Layers Board)
spacing copperThickness1oz (default): track to track 0.102, other pairs 0.152 to 0.3
spacing copperThickness2oz: track to track 0.203, other pairs 0.152 to 0.3
track width copperThickness1oz (default): min 0.127, default 0.254, max 2.54
track width copperThickness2oz: min 0.203, default 0.254, max 2.54
differential pair differentialPair (default): width min 0.127, default 0.254, max 2.54; gap min 0.152, default 0.152
via viaSize (default): diameter min 0.5, default 0.61, max 10; hole min 0.3, default 0.305, max 6.3

## Placement (name value [footprint] x y rotation side)
C1  100nF  [C0402]  6.44 30.83 90 top
C2  22uF  [C0805]  13.68 31.34 180 top
C3  22uF  [C0805]  13.68 29.18 180 top
C4  10uF  [C0603]  6.7 23.97 90 top
C5  100nF  [C0402]  8.22 24.1 90 top
C6  47uF  [CAP-SMD_L7.3-W4.3-FD]  25.27 23.38 0 top
C7  75pF  [C0402]  7.84 30.83 90 top
C8  10uF  [CASE-C_6032]  8.73 34.51 180 bottom
C9  100nF  [C0402]  27.69 16.52 180 top
C10  10uF  [C0603]  25.15 17.15 270 top
C11  100nF  [C0402]  19.14 19.43 270 top
C12  22uF  [C0805]  14.66 24.8 90 top
C13  22uF  [C0805]  14.66 24.8 90 bottom
C14  10uF  [C0603]  34.42 12.96 90 top
C15  10uF  [C0603]  32.64 12.96 90 top
C16  100pF  [C0402]  16.22 19.51 270 top
C17  10uF  [CASE-C_6032]  25.4 27.95 180 top
C18  10uF  [C0603]  38.16 20.37 90 top
C19  1nF  [C0603]  39.81 25.7 270 top
C20  1nF  [C0603]  47.93 28.5 0 top
D1  SS14  [SMA_L4.2-W2.6-LS5.3-RD]  8.6 24.86 180 bottom
D2  SMCJ24CAX  [SMC_L6.9-W5.9-LS7.9-BI]  26.8 28.33 180 bottom
D3  SS14  [SMA_L4.3-W2.6-LS5.2-RD]  32.38 17.66 0 top
D4  SS14  [SMA_L4.3-W2.6-LS5.2-RD]  39.24 15.12 180 top
D5  SMBJ36CA  [SMB_L4.6-W3.6-LS5.4-RD]  39.24 11.44 0 top
D6  SMBJ12CA  [SMB_L4.6-W3.6-LS5.4-RD]  47.24 31.25 270 bottom
D7  M7  [SMA_L4.3-W2.6-LS5.0-FD]  33.65 21.19 180 top
D8  M7  [SMA_L4.3-W2.6-LS5.0-FD]  33.65 24.11 0 top
D9  1N4148W  [SOD-123_L2.7-W1.6-LS3.7-FD]  32.38 27.95 90 top
F1  BSMD1812-050-30V  [F1812]  16.51 29.47 180 bottom
L1  10uH  [IND-SMD_L4.4-W4.2]  7.97 29.56 90 bottom
L2  4.7uH  [IND-SMD_L7.0-W6.6]  27.94 13.85 180 bottom
L3  15uH  [IND-SMD_L4.0-W4.0]  17.96 21.12 90 bottom
Q1  SK2301AA  [SOT-23-3_L2.9-W1.6-P1.90-LS2.8-BR]  35.23 27.61 0 top
Q2  SS8050  [SOT-23-3_L2.9-W1.3-P1.90-LS2.4-BR]  42.47 25.57 270 bottom
R1  49.9Ω  [R0402]  10.38 30.7 270 top
R2  511kΩ  [R0603]  11.01 24.23 270 top
R3  105kΩ  [R0402]  9.49 24.35 270 top
R4  100kΩ  [R0402]  9.11 30.7 90 top
R5  13.3kΩ  [R0603]  10.76 27.91 90 top
R6  49.9Ω  [R0402]  17.71 19.6 90 top
R7  511kΩ  [R0603]  17.45 26.07 90 top
R8  27kΩ  [R0603]  24.13 14.23 0 top
R9  2kΩ  [R0603]  24.89 11.94 90 top
R10  100kΩ  [R0402]  30.99 13.34 90 top
R11  100kΩ  [R0402]  13.84 19.56 270 top
R12  105kΩ  [R0402]  18.85 25.69 270 top
R13  5.23kΩ  [R0603]  14.79 21.63 0 top
R14  10kΩ  [R0603]  40.82 31.16 90 bottom
R15  27kΩ  [R0603]  42.35 31.16 90 bottom
R16  0Ω  [R0603]  44 31.16 90 bottom
R17  100kΩ  [R0603]  39.3 31.16 90 bottom
R18  47Ω  [R0603]  36.25 31.16 90 top
R19  47Ω  [R0603]  38.16 25.83 270 bottom
R20  10kΩ  [R0603]  39.81 25.83 90 bottom
R21  470Ω  [R0603]  37.77 31.16 90 bottom
R22  200Ω  [R0603]  38.16 25.83 90 top
R23  200Ω  [R0603]  41.46 25.7 270 top
R24  0Ω  [R0603]  36.32 34.3 90 top
R25  10kΩ  [R0603]  46.28 25.83 90 bottom
R26  2kΩ  [R0603]  44.76 25.83 270 bottom
SCREW1  -  [M2螺丝]  8.89 3.82 0 top
SCREW2  -  [M2螺丝]  41.15 41.03 0 top
U1  TPS54302DDCR  [SOT-23-6_L2.9-W1.6-P0.95-LS2.8-BL]  8.22 27.53 0 top
U2  TPS54302DDCR  [SOT-23-6_L2.9-W1.6-P0.95-LS2.8-BL]  17.96 22.77 180 top
U3  MP2359DJ-LF-Z  [SOT-23-6_L2.9-W1.6-P0.95-LS2.8-BR]  28.07 13.85 180 top
U4  TP2274-SR  [SOIC-14_L8.7-W3.9-P1.27-LS6.0-BL]  41.9 31.36 0 top
U5  -  [LC8+LZ8V-2.54 5PIN]  18.8 33.66 0 top
U6  ZX-XH2.54-5PZZ  [CONN-TH_5P-P2.50_ZX-XH2.54-5PZZ]  46.35 15.25 270 top

## Footprints (pads in the part's own frame, mm; a bottom-side part is the same pattern mirrored in y, then rotated)
C0402
  rect 0.79x0.54 smd: 1(-0.545,0) 2(0.545,0)
C0603
  rect 0.8x0.9 smd: 1(-0.7,0) 2(0.7,0)
C0805
  rect 1.41x1.35 smd: 1(-1,0) 2(1,0)
CAP-SMD_L7.3-W4.3-FD
  rect 2.185x2.592 smd: 1(-3.437,0) 2(3.437,0)
CASE-C_6032
  rect 2.425x2.5 smd: 1(3.022,0) 2(-3.022,0)
CONN-TH_5P-P2.50_ZX-XH2.54-5PZZ
  rect 1.524x1.6 hole 1.1: 1(-5,0)
  round 1.6 hole 1.1: 2(-2.5,0) 3(0,0) 4(2.5,0) 5(5,0)
F1812
  rect 1.407x3.499 smd: 1(-1.853,0) 2(1.853,0)
IND-SMD_L4.0-W4.0
  rect 1.6x3.5 smd: 1(-1.6,0) 2(1.6,0)
IND-SMD_L4.4-W4.2
  rect 1.4x2.12 smd: 1(2.028,0) 2(-2.028,0)
IND-SMD_L7.0-W6.6
  rect 2.4x3.2 smd: 1(-3,0) 2(3,0)
LC8+LZ8V-2.54 5PIN
  rect 2x2 hole 1.5: 1(0,0)
  round 2 hole 1.5: 2(2.54,0) 3(5.08,0) 4(7.62,0) 5(10.16,0) 6(12.7,0)
M2螺丝
  round 2 hole 2: 1(0,0)
R0402
  rect 0.566x0.54 smd: 1(-0.433,0) 2(0.433,0)
R0603
  rect 0.806x0.864 smd: 1(-0.753,0) 2(0.753,0)
SMA_L4.2-W2.6-LS5.3-RD
  rect 2.2x1.7 smd: 1(-2.566,0) 2(2.566,0)
SMA_L4.3-W2.6-LS5.0-FD
  rect 2.046x1.62 smd: 1(-2.304,-0.009) 2(2.304,0.009)
SMA_L4.3-W2.6-LS5.2-RD
  rect 2x2 smd: 1(-2.2,0) 2(2.2,0)
SMB_L4.6-W3.6-LS5.4-RD
  rect 2.047x2.241 smd: 1(-2.413,0) 2(2.413,0)
SMC_L6.9-W5.9-LS7.9-BI
  rect 3.03x3.82 smd: 1(-3.435,0) 2(3.435,0)
SOD-123_L2.7-W1.6-LS3.7-FD
  rect 0.88x0.96 smd: 1(-1.61,0) 2(1.61,0)
SOIC-14_L8.7-W3.9-P1.27-LS6.0-BL
  oval 0.574x2.038 smd: 1(-3.81,-2.769) 2(-2.54,-2.769) 3(-1.27,-2.769) 4(0,-2.769) 5(1.27,-2.769) 6(2.54,-2.769) 7(3.81,-2.769) 8(3.81,2.769) 9(2.54,2.769) 10(1.27,2.769) 11(0,2.769) 12(-1.27,2.769) 13(-2.54,2.769) 14(-3.81,2.769)
SOT-23-3_L2.9-W1.3-P1.90-LS2.4-BR
  rect 1.25x0.7 smd: 1(1,-0.95) 2(1,0.95) 3(-1,0)
SOT-23-3_L2.9-W1.6-P1.90-LS2.8-BR
  rect 1.07x0.6 smd: 1(1.235,-0.95) 2(1.235,0.95) 3(-1.235,0)
SOT-23-6_L2.9-W1.6-P0.95-LS2.8-BL
  rect 0.532x1.072 smd: 1(-0.95,-1.149) 2(0,-1.149) 3(0.95,-1.149) 4(0.95,1.149) 5(0,1.149) 6(-0.95,1.149)
SOT-23-6_L2.9-W1.6-P0.95-LS2.8-BR
  rect 1.1x0.6 smd: 1(1.35,-0.95) 2(1.35,0) 3(1.35,0.95) 4(-1.35,0.95) 5(-1.35,0) 6(-1.35,-0.95)

## Nets
As in the schematic.
